# EAGLE design PixelLeaf RP2040 (EAGLE 9.5.2)
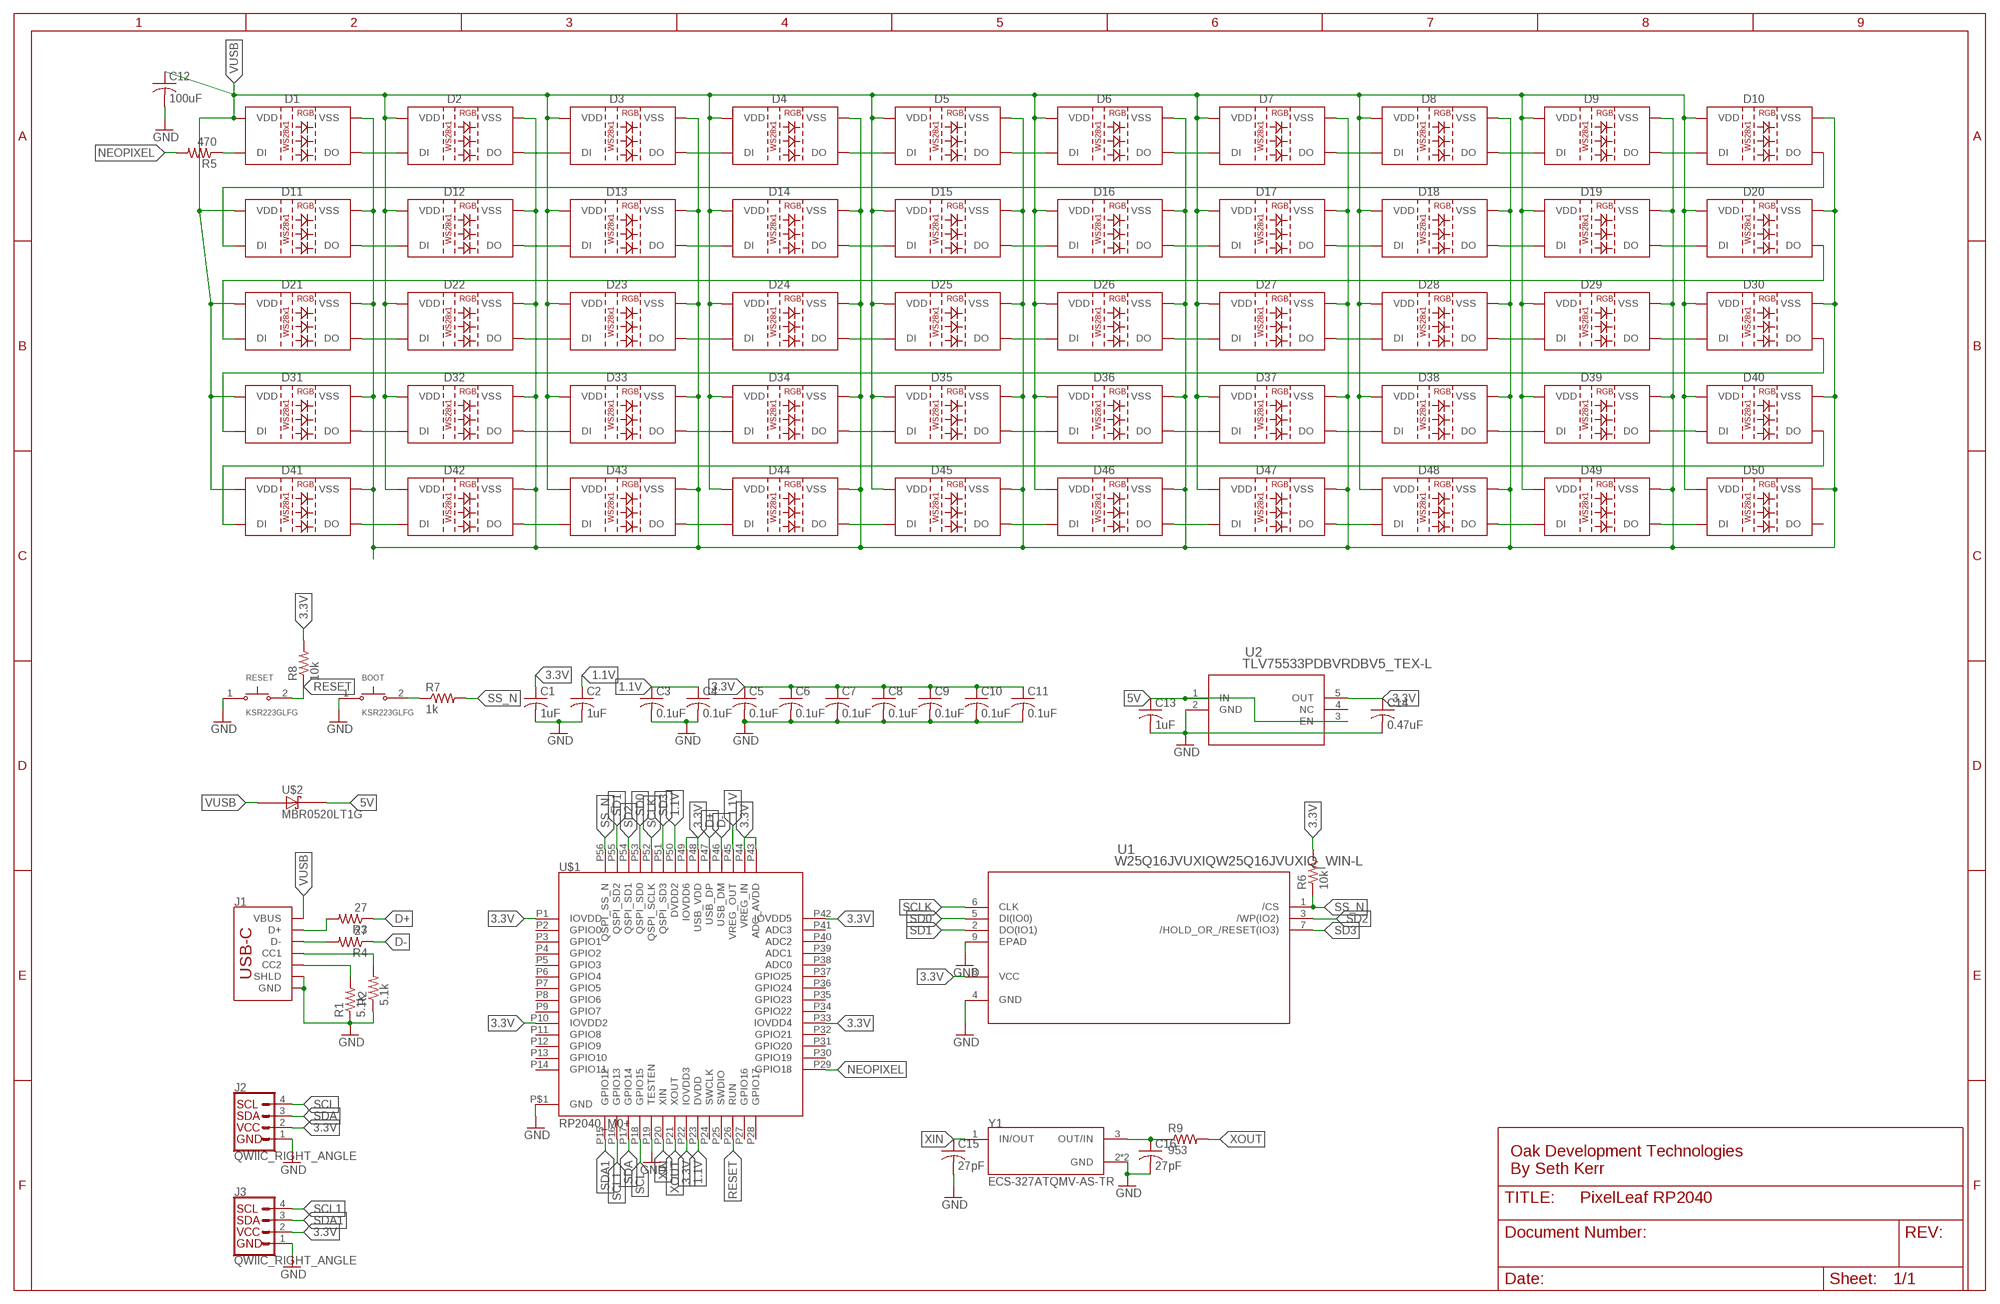
[diagram p0: schematic, sheet 1]

## Parts
BOOT  KSR223GLFG  [SW_KSR223GLFG]
C1  1uF  C-USC0603  [C0603]
C2  1uF  C-USC0603  [C0603]
C3  0.1uF  C-USC0603  [C0603]
C4  0.1uF  C-USC0603  [C0603]
C5  0.1uF  C-USC0603  [C0603]
C6  0.1uF  C-USC0603  [C0603]
C7  0.1uF  C-USC0603  [C0603]
C8  0.1uF  C-USC0603  [C0603]
C9  0.1uF  C-USC0603  [C0603]
C10  0.1uF  C-USC0603  [C0603]
C11  0.1uF  C-USC0603  [C0603]
C12  100uF  C-USC1206  [C1206]
C13  1uF  C-USC0603  [C0603]
C14  0.47uF  C-USC0603  [C0603]
C15  27pF  C-USC0402  [C0402]
C16  27pF  C-USC0402  [C0402]
D1  WS2812BWS2812B-3535  [WS2812-3535]
D2  WS2812BWS2812B-3535  [WS2812-3535]
D3  WS2812BWS2812B-3535  [WS2812-3535]
D4  WS2812BWS2812B-3535  [WS2812-3535]
D5  WS2812BWS2812B-3535  [WS2812-3535]
D6  WS2812BWS2812B-3535  [WS2812-3535]
D7  WS2812BWS2812B-3535  [WS2812-3535]
D8  WS2812BWS2812B-3535  [WS2812-3535]
D9  WS2812BWS2812B-3535  [WS2812-3535]
D10  WS2812BWS2812B-3535  [WS2812-3535]
D11  WS2812BWS2812B-3535  [WS2812-3535]
D12  WS2812BWS2812B-3535  [WS2812-3535]
D13  WS2812BWS2812B-3535  [WS2812-3535]
D14  WS2812BWS2812B-3535  [WS2812-3535]
D15  WS2812BWS2812B-3535  [WS2812-3535]
D16  WS2812BWS2812B-3535  [WS2812-3535]
D17  WS2812BWS2812B-3535  [WS2812-3535]
D18  WS2812BWS2812B-3535  [WS2812-3535]
D19  WS2812BWS2812B-3535  [WS2812-3535]
D20  WS2812BWS2812B-3535  [WS2812-3535]
D21  WS2812BWS2812B-3535  [WS2812-3535]
D22  WS2812BWS2812B-3535  [WS2812-3535]
D23  WS2812BWS2812B-3535  [WS2812-3535]
D24  WS2812BWS2812B-3535  [WS2812-3535]
D25  WS2812BWS2812B-3535  [WS2812-3535]
D26  WS2812BWS2812B-3535  [WS2812-3535]
D27  WS2812BWS2812B-3535  [WS2812-3535]
D28  WS2812BWS2812B-3535  [WS2812-3535]
D29  WS2812BWS2812B-3535  [WS2812-3535]
D30  WS2812BWS2812B-3535  [WS2812-3535]
D31  WS2812BWS2812B-3535  [WS2812-3535]
D32  WS2812BWS2812B-3535  [WS2812-3535]
D33  WS2812BWS2812B-3535  [WS2812-3535]
D34  WS2812BWS2812B-3535  [WS2812-3535]
D35  WS2812BWS2812B-3535  [WS2812-3535]
D36  WS2812BWS2812B-3535  [WS2812-3535]
D37  WS2812BWS2812B-3535  [WS2812-3535]
D38  WS2812BWS2812B-3535  [WS2812-3535]
D39  WS2812BWS2812B-3535  [WS2812-3535]
D40  WS2812BWS2812B-3535  [WS2812-3535]
D41  WS2812BWS2812B-3535  [WS2812-3535]
D42  WS2812BWS2812B-3535  [WS2812-3535]
D43  WS2812BWS2812B-3535  [WS2812-3535]
D44  WS2812BWS2812B-3535  [WS2812-3535]
D45  WS2812BWS2812B-3535  [WS2812-3535]
D46  WS2812BWS2812B-3535  [WS2812-3535]
D47  WS2812BWS2812B-3535  [WS2812-3535]
D48  WS2812BWS2812B-3535  [WS2812-3535]
D49  WS2812BWS2812B-3535  [WS2812-3535]
D50  WS2812BWS2812B-3535  [WS2812-3535]
J1  USB_C_2-LAYER_PADS  [USB-C-16P-2LAYER-PADS]
J2  QWIIC_RIGHT_ANGLE  QWIIC_CONNECTORJS-1MM  [JST04_1MM_RA]
J3  QWIIC_RIGHT_ANGLE  QWIIC_CONNECTORJS-1MM  [JST04_1MM_RA]
R1  5.1k  R-US_R0603  [R0603]
R2  5.1k  R-US_R0603  [R0603]
R3  27  R-US_R0603  [R0603]
R4  27  R-US_R0603  [R0603]
R5  470  R-US_R0603  [R0603]
R6  10k  R-US_R0603  [R0603]
R7  1k  R-US_R0603  [R0603]
R8  10k  R-US_R0603  [R0603]
R9  953  R-US_R0402  [R0402]
RESET  KSR223GLFG  [SW_KSR223GLFG]
U1  W25Q16JVUXIQW25Q16JVUXIQ_WIN-L  [W25Q16JVUXIQ_WIN-L]
U2  TLV75533PDBVRDBV5_TEX-L  [DBV5_TEX-L]
U$1  RP2040_M0+  [QFN-56]
U$2  MBR0520LT1G  [SOD3716X117(SOD-123)]
Y1  ECS-327ATQMV-AS-TR  [XTAL_ECS-327ATQMV-AS-TR]

## Nets
1.1V: C2.1 C3.1 C4.1 U$1.P23(DVDD) U$1.P45(VREG_OUT) U$1.P50(DVDD2)
3.3V: C1.1 C5.1 C6.1 C7.1 C8.1 C9.1 C10.1 C11.1 C14.1 J2.2 J3.2 R6.2 R8.2 U1.8(VCC) U2.5(OUT) U$1.P1(IOVDD) U$1.P10(IOVDD2) U$1.P22(IOVDD3) U$1.P33(IOVDD4) U$1.P42(IOVDD5) U$1.P43(ADC_AVDD) U$1.P44(VREG_IN) U$1.P48(USB_VDD) U$1.P49(IOVDD6)
5V: C13.1 U2.1(IN) U2.3(EN) U$2.1(C)
D+: R3.1 U$1.P47(USB_DP)
D-: R4.1 U$1.P46(USB_DM)
GND: BOOT.1 C1.2 C2.2 C3.2 C4.2 C5.2 C6.2 C7.2 C8.2 C9.2 C10.2 C11.2 C12.2 C13.2 C14.2 C15.2 C16.2 D1.VSS D2.VSS D3.VSS D4.VSS D5.VSS D6.VSS D7.VSS D8.VSS D9.VSS D10.VSS D11.VSS D12.VSS D13.VSS D14.VSS D15.VSS D16.VSS D17.VSS D18.VSS D19.VSS D20.VSS D21.VSS D22.VSS D23.VSS D24.VSS D25.VSS D26.VSS D27.VSS D28.VSS D29.VSS D30.VSS D31.VSS D32.VSS D33.VSS D34.VSS D35.VSS D36.VSS D37.VSS D38.VSS D39.VSS D40.VSS D41.VSS D42.VSS D43.VSS D44.VSS D45.VSS D46.VSS D47.VSS D48.VSS D49.VSS D50.VSS J1.GND J1.GND2(GND) J1.P$1(SHLD) J1.P$2(SHLD) J1.P$3(SHLD) J1.P$4(SHLD) J1.SHLD1(SHLD) J1.SHLD2(SHLD) J1.SHLD3(SHLD) J1.SHLD4(SHLD) J2.1 J3.1 R1.1 R2.1 RESET.1 U1.4(GND) U1.9(EPAD) U2.2(GND) U$1.P19(TESTEN) U$1.P$1(GND) Y1.2(GND) Y1.4(GND)
N$1: J1.A6(D+) J1.B6(D+) R3.2
N$2: J1.A7(D-) J1.B7(D-) R4.2
N$3: J1.A5(CC1) R2.2
N$4: J1.B5(CC2) R1.2
N$5: D1.DIN(DI) R5.1
N$8: C16.1 R9.1 Y1.3(OUT/IN)
N$12: D41.DOUT(DO) D42.DIN(DI)
N$13: D42.DOUT(DO) D43.DIN(DI)
N$14: D43.DOUT(DO) D44.DIN(DI)
N$15: D44.DOUT(DO) D45.DIN(DI)
N$16: D45.DOUT(DO) D46.DIN(DI)
N$17: D46.DOUT(DO) D47.DIN(DI)
N$18: D47.DOUT(DO) D48.DIN(DI)
N$19: D48.DOUT(DO) D49.DIN(DI)
N$20: D49.DOUT(DO) D50.DIN(DI)
N$21: D40.DOUT(DO) D41.DIN(DI)
N$22: D31.DOUT(DO) D32.DIN(DI)
N$23: D32.DOUT(DO) D33.DIN(DI)
N$24: D33.DOUT(DO) D34.DIN(DI)
N$25: D34.DOUT(DO) D35.DIN(DI)
N$26: D35.DOUT(DO) D36.DIN(DI)
N$27: D36.DOUT(DO) D37.DIN(DI)
N$28: D37.DOUT(DO) D38.DIN(DI)
N$29: D38.DOUT(DO) D39.DIN(DI)
N$30: D39.DOUT(DO) D40.DIN(DI)
N$31: D30.DOUT(DO) D31.DIN(DI)
N$32: D21.DOUT(DO) D22.DIN(DI)
N$33: D22.DOUT(DO) D23.DIN(DI)
N$34: D23.DOUT(DO) D24.DIN(DI)
N$35: D24.DOUT(DO) D25.DIN(DI)
N$36: D25.DOUT(DO) D26.DIN(DI)
N$37: D26.DOUT(DO) D27.DIN(DI)
N$38: D27.DOUT(DO) D28.DIN(DI)
N$39: D28.DOUT(DO) D29.DIN(DI)
N$40: D29.DOUT(DO) D30.DIN(DI)
N$41: D20.DOUT(DO) D21.DIN(DI)
N$42: D11.DOUT(DO) D12.DIN(DI)
N$43: D12.DOUT(DO) D13.DIN(DI)
N$44: D13.DOUT(DO) D14.DIN(DI)
N$45: D14.DOUT(DO) D15.DIN(DI)
N$46: D15.DOUT(DO) D16.DIN(DI)
N$47: D16.DOUT(DO) D17.DIN(DI)
N$48: D17.DOUT(DO) D18.DIN(DI)
N$49: D18.DOUT(DO) D19.DIN(DI)
N$50: D19.DOUT(DO) D20.DIN(DI)
N$51: D10.DOUT(DO) D11.DIN(DI)
N$52: D1.DOUT(DO) D2.DIN(DI)
N$53: D2.DOUT(DO) D3.DIN(DI)
N$54: D3.DOUT(DO) D4.DIN(DI)
N$55: D4.DOUT(DO) D5.DIN(DI)
N$56: D5.DOUT(DO) D6.DIN(DI)
N$57: D6.DOUT(DO) D7.DIN(DI)
N$58: D7.DOUT(DO) D8.DIN(DI)
N$59: D8.DOUT(DO) D9.DIN(DI)
N$60: D9.DOUT(DO) D10.DIN(DI)
N$69: BOOT.2 R7.1
NEOPIXEL: R5.2 U$1.P29(GPIO18)
RESET: R8.1 RESET.2 U$1.P26(RUN)
SCL: J2.4 U$1.P18(GPIO15)
SCL1: J3.4 U$1.P16(GPIO13)
SCLK: U1.6(CLK) U$1.P52(QSPI_SCLK)
SD0: U1.5(DI(IO0)) U$1.P53(QSPI_SD0)
SD1: U1.2(DO(IO1)) U$1.P55(QSPI_SD2)
SD2: U1.3(/WP(IO2)) U$1.P54(QSPI_SD1)
SD3: U1.7(/HOLD_OR_/RESET(IO3)) U$1.P51(QSPI_SD3)
SDA: J2.3 U$1.P17(GPIO14)
SDA1: J3.3 U$1.P15(GPIO12)
SS_N: R6.1 R7.2 U1.1(/CS) U$1.P56(QSPI_SS_N)
VUSB: C12.1 D1.VDD D2.VDD D3.VDD D4.VDD D5.VDD D6.VDD D7.VDD D8.VDD D9.VDD D10.VDD D11.VDD D12.VDD D13.VDD D14.VDD D15.VDD D16.VDD D17.VDD D18.VDD D19.VDD D20.VDD D21.VDD D22.VDD D23.VDD D24.VDD D25.VDD D26.VDD D27.VDD D28.VDD D29.VDD D30.VDD D31.VDD D32.VDD D33.VDD D34.VDD D35.VDD D36.VDD D37.VDD D38.VDD D39.VDD D40.VDD D41.VDD D42.VDD D43.VDD D44.VDD D45.VDD D46.VDD D47.VDD D48.VDD D49.VDD D50.VDD J1.VBUS1(VBUS) J1.VBUS2(VBUS) U$2.2(A)
XIN: C15.1 U$1.P20(XIN) Y1.1(IN/OUT)
XOUT: R9.2 U$1.P21(XOUT)
Unconnected: D50.DOUT(DO) U2.4(NC) U$1.P2(GPIO0) U$1.P3(GPIO1) U$1.P4(GPIO2) U$1.P5(GPIO3) U$1.P6(GPIO4) U$1.P7(GPIO5) U$1.P8(GPIO6) U$1.P9(GPIO7) U$1.P11(GPIO8) U$1.P12(GPIO9) U$1.P13(GPIO10) U$1.P14(GPIO11) U$1.P24(SWCLK) U$1.P25(SWDIO) U$1.P27(GPIO16) U$1.P28(GPIO17) U$1.P30(GPIO19) U$1.P31(GPIO20) U$1.P32(GPIO21) U$1.P34(GPIO22) U$1.P35(GPIO23) U$1.P36(GPIO24) U$1.P37(GPIO25) U$1.P38(ADC0) U$1.P39(ADC1) U$1.P40(ADC2) U$1.P41(ADC3)

## Notes on the sheet
- Oak Development Technologies
  By Seth Kerr

## Library data of the parts
BOOT RESET = KSR223GLFG:KSR223GLFG: Switch Tactile N.O. SPST Round Button Gull Wing 0.01A 32VDC 0.2VA 200000Cycles 2N SMD Automotive T/R; AVAILABILITY: Unavailable; DESCRIPTION: Tactile Switch SPST-NO Top Actuated Surface Mount; MF: C&K; MP: KSR223GLFG; PACKAGE: None; PRICE: None
C1-C16 = rcl:C-US: CAPACITOR, American symbol; SPICEPREFIX: C
D1-D50 = SparkFun-LED:WS2812B: WS2812B SMD addressable RGB LED 5x5mm SMD LED with built-in controller IC. Color: Red/Green/Blue mC Rating: RGB: 390, 660, 180 mcd Forward Voltage: RGB: 2.0, 3.0, 3.0 V Packages:WS2812B SparkFun Products: Blynk Board - ESP8266 <https://www.sparkfun.com/products/13794>
J1 = SparkFun-Connectors:USB_C: USB Type C 16Pin Connector Super Speed pins not available on the 16-pin purely SMD connector so this part is best for USB 2.0 implementations. D1 and D2 are tied together enabling D+/- no matter which way the cable is plugged into the connector. The two channel configuration pins (CC1/2) are exposed. These are normally connected to ground via 5.1k resistors but can be reconfigured for high current/high power applications.; PROD_ID: CONN-14122
J2 J3 = SparkFun-Connectors:QWIIC_CONNECTOR: SparkFun I2C Standard Qwiic Connector An SMD 1mm pitch JST connector makes it easy and quick (get it? Qwiic?) to connect I2C devices to each other. The Qwiic system <http://www.sparkfun.com/qwiic> enables fast and solderless connection between popular platforms and various sensors and actuators. We carry 200mm <https://www.sparkfun.com/products/14204>, 100mm <https://www.sparkfun.com/products/14205>, 50mm <https://www.sparkfun.com/products/14206>, and breadboard friendly <https://www.sparkfun.com/products/14207> Qwiic cables. We also offer 10 pcs strips <https://www.sparkfun.com/products/14323> the SMD connectors.; PROD_ID: CONN-13694
R1-R9 = rcl:R-US_: RESISTOR, American symbol; SPICEPREFIX: R
U1 = Winbond SPI Flash:W25Q16JVUXIQ; BUILT_BY: EMA_Colton; COPYRIGHT: Copyright (C) 2018 Accelerated Designs. All rights reserved; DATASHEET: https://www.mouser.com/datasheet/2/949/w25n01gw_reve_021318_unsecured-1489855.pdf; MANUFACTURER_PART_NUMBER: W25Q16JVUXIQ; SOURCELIBRARY: Winbond_2020-03-18; VENDOR: Winbond
U2 = TLV75533pdbvr:TLV75533PDBVR; COPYRIGHT: Copyright (C) 2018 Accelerated Designs. All rights reserved; MANUFACTURER_PART_NUMBER: TLV75533PDBVR; SOURCELIBRARY: TI_2019-06-18; VENDOR: Texas Instruments
U$1 = RP2040_M0:RP2040_M0+
U$2 = MBR0520LT1G:MBR0520LT1G: Surface Mount Schottky Power Rectifier Plastic SOD−123 Package; AVAILABILITY: Unavailable; DESCRIPTION: Diode Schottky 20V 500mA Surface Mount SOD-123; MF: ON Semiconductor; MP: MBR0520LT1G; PACKAGE: SOD-123 ON Semiconductor; PRICE: None
Y1 = ECS-327ATQMV-AS-TR:ECS-327ATQMV-AS-TR: The ECX-33Q is a miniature SMD Crystal with a 3.2 x 2.5 mm footprint. AEC-Q200 Qualified.; ARROW_ELECTRONICS-PURCHASE-URL: https://snapeda.com/shop?store=Arrow+Electronics&id=3210300; DESCRIPTION: 32.768kHz XO (Standard) CMOS Oscillator 1.62V ~ 3.63V Enable/Disable 4-SMD, No Lead; DIGI-KEY_PART_NUMBER: XC2826CT-ND; MF: ECS Inc.; MOUSER-PURCHASE-URL: https://snapeda.com/shop?store=Mouser&id=3210300; MP: ECS-327ATQMV-AS-TR; PACKAGE: SMD-4 ECS Inc.

## Board
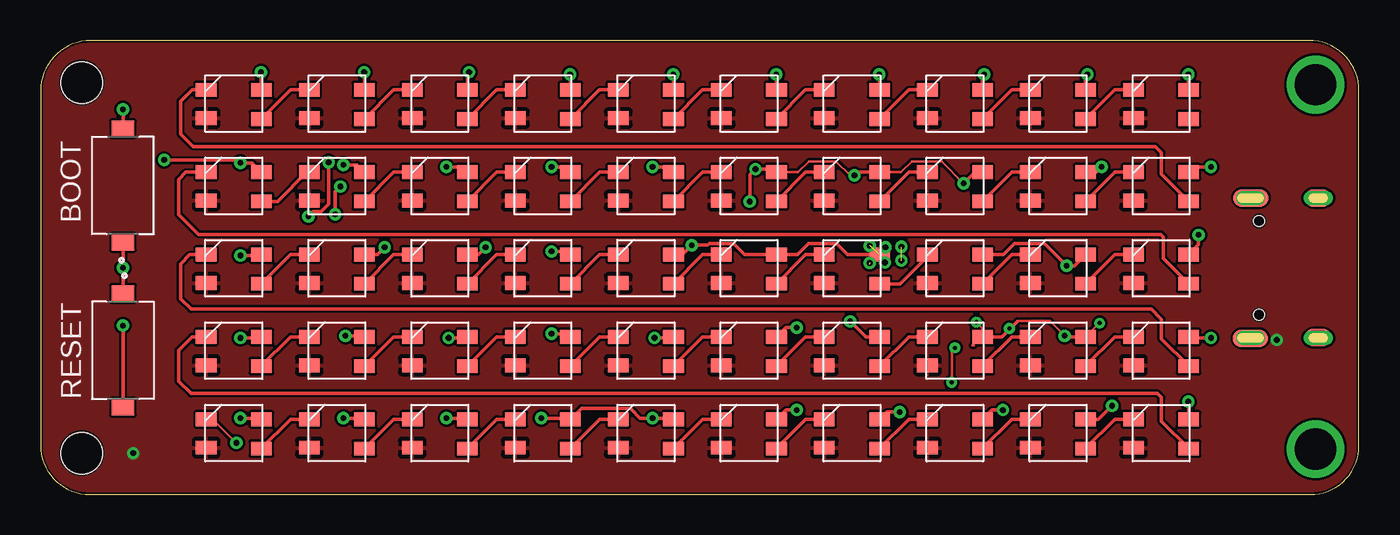
[diagram p1: board, top side]
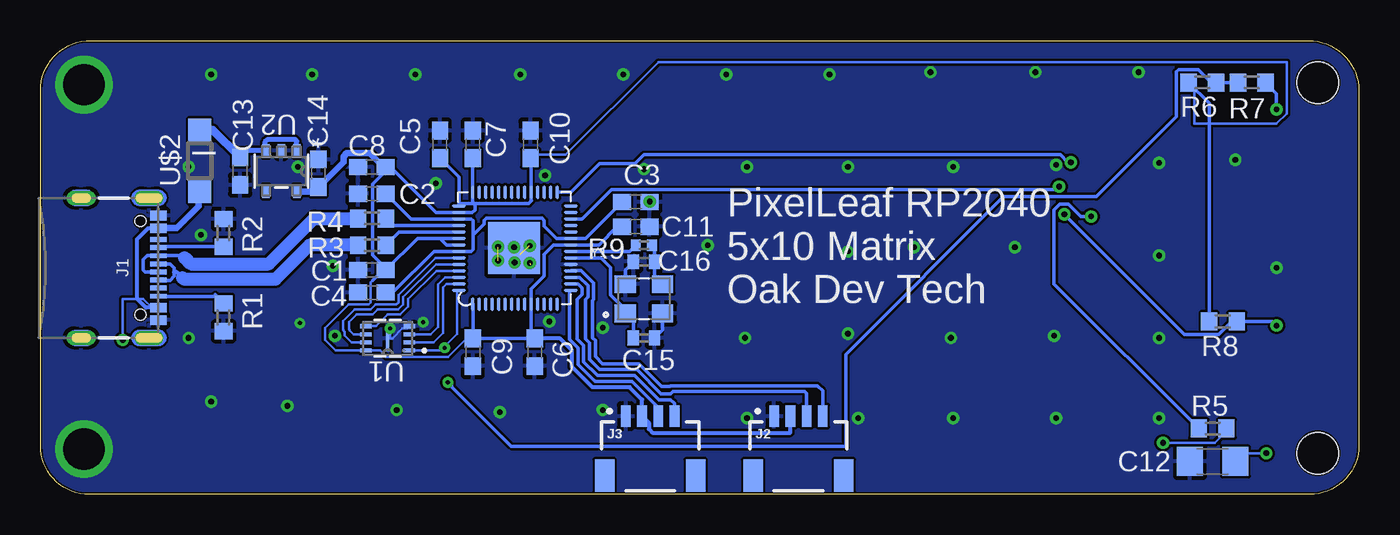
[diagram p2: board, bottom side, seen from below]

Size 81.26 x 27.99 mm. Coordinates in mm from the lower left corner, seen from the top.
Outline: 0,24.88 0,3.04 arc90 3.04,0 78.26,0 arc90 81.26,3 81.26,24.9 arc90 78.17,27.99 3.11,27.99 arc90 0,24.88
Copper layers (1*16): Top 0.035mm / dielectric 1.5mm / Bottom 0.035mm
Design rules "default *": minimum track width 6mil, minimum drill 10mil, track to track 6mil, track to pad 6mil, pad to pad 6mil, via to via 6mil, smd to smd 6mil, copper to edge 5mil, drill to drill 6mil, minimum pad ring 10mil, minimum via ring 8mil, stop-mask expansion 1mil, vias tented up to drill 15mil, thermal gap 10mil
Holes 2.54 mm at 2.54,2.54 2.54,25.4

### Footprints (pad centres in the part's own frame; a part is rotated, then mirrored left to right if it is on the bottom)
SW_KSR223GLFG = smd 1 x 1.4: 1 -3.5,0; 2 3.5,0
C0603 = smd 1.1 x 1: 1 -0.85,0; 2 0.85,0
C1206 = smd 1.6 x 1.8: 1 -1.4,0; 2 1.4,0
C0402 = smd 0.7 x 0.9: 1 -0.65,0; 2 0.65,0
WS2812-3535 = smd 1.27 x 0.85: DIN 0.05,2.6; DOUT 3.45,0.8; VDD 0.05,0.85; VSS 3.45,2.6
USB-C-16P-2LAYER-PADS = smd 0.3 x 1: A5 -1.25,-0.34; A6 -0.25,-0.34; A7 0.25,-0.34; A8 1.25,-0.34; B5 1.75,-0.34; B6 0.75,-0.34; B7 -0.75,-0.34; B8 -1.75,-0.34 | smd 0.6 x 1: GND -3.225,-0.34; GND2 3.225,-0.34; VBUS1 -2.45,-0.34; VBUS2 2.45,-0.34 | smd 1.067 x 2.184 bottom: P$1 -4.318,-0.94; P$2 4.343,-0.914 | smd 1.067 x 1.676 bottom: P$3 -4.318,-5.08; P$4 4.293,-5.08 | drill 0.4 pad 0.6 long: SHLD1 -4.318,-0.915; SHLD2 4.318,-0.915; SHLD3 -4.318,-5.095; SHLD4 4.318,-5.095 | hole 0.65: -2.89,-1.445; 2.89,-1.445
JST04_1MM_RA = smd 0.6 x 1.35: 1 -1.5,0; 2 -0.5,0; 3 0.5,0; 4 1.5,0 | smd 1.2 x 2: NC1 2.8,-3.675; NC2 -2.8,-3.675
R0603 = smd 1 x 1.1: 1 -0.85,0; 2 0.85,0
R0402 = smd 0.6 x 0.7: 1 -0.5,0; 2 0.5,0
W25Q16JVUXIQ_WIN-L = smd 0.711 x 0.254: 1 -1.348,0.75; 2 -1.348,0.25; 3 -1.348,-0.25; 4 -1.348,-0.75; 5 1.348,-0.75; 6 1.348,-0.25; 7 1.348,0.25; 8 1.348,0.75 | smd 0.203 x 1.6: 9 0,0
DBV5_TEX-L = smd 0.775 x 0.457: 1 -1.264,0.95; 2 -1.264,0; 3 -1.264,-0.95; 4 1.264,-0.95; 5 1.264,0.95
QFN-56 = smd 0.875 x 0.2: P1 -3.5,2.55; P2 -3.5,2.15; P3 -3.5,1.75; P4 -3.5,1.35; P5 -3.5,0.95; P6 -3.5,0.55; P7 -3.5,0.15; P8 -3.5,-0.25; P9 -3.5,-0.65; P10 -3.5,-1.05; P11 -3.5,-1.45; P12 -3.5,-1.85; P13 -3.5,-2.25; P14 -3.5,-2.65; P29 3.4,-2.65; P30 3.4,-2.25; P31 3.4,-1.85; P32 3.4,-1.45; P33 3.4,-1.05; P34 3.4,-0.65; P35 3.4,-0.25; P36 3.4,0.15; P37 3.4,0.55; P38 3.4,0.95; P39 3.4,1.35; P40 3.4,1.75; P41 3.4,2.15; P42 3.4,2.55 | smd 0.2 x 0.875: P15 -2.65,-3.5; P16 -2.25,-3.5; P17 -1.85,-3.5; P18 -1.45,-3.5; P19 -1.05,-3.5; P20 -0.65,-3.5; P21 -0.25,-3.5; P22 0.15,-3.5; P23 0.55,-3.5; P24 0.95,-3.5; P25 1.35,-3.5; P26 1.75,-3.5; P27 2.15,-3.5; P28 2.55,-3.5; P43 2.55,3.4; P44 2.15,3.4; P45 1.75,3.4; P46 1.35,3.4; P47 0.95,3.4; P48 0.55,3.4; P49 0.15,3.4; P50 -0.25,3.4; P51 -0.65,3.4; P52 -1.05,3.4; P53 -1.45,3.4; P54 -1.85,3.4; P55 -2.25,3.4; P56 -2.65,3.4 | smd 3.2 x 3.2: P$1 -0.05,0
SOD3716X117(SOD-123) = smd 1.4 x 1.4: 1 -1.9,0.051; 2 1.9,0.051
XTAL_ECS-327ATQMV-AS-TR = smd 1.3 x 1.1: 1 -1.15,-0.9; 2 1.15,-0.9; 3 1.15,0.9; 4 -1.15,0.9

### Placement (x,y rotation side)
BOOT  5.08,19.05 90 top
C1  60.83,13.84 180 bottom
C2  60.83,18.54 180 bottom
C3  44.58,18.03 0 bottom
C4  60.83,12.45 180 bottom
C5  56.64,21.59 90 bottom
C6  50.8,8.76 270 bottom
C7  54.61,21.59 90 bottom
C8  60.83,20.19 180 bottom
C9  54.61,8.76 270 bottom
C10  51.05,21.59 90 bottom
C11  44.58,16.51 0 bottom
C12  9.02,2.03 180 bottom
C13  68.96,19.94 270 bottom
C14  64.14,19.81 90 bottom
C15  44.07,9.65 0 bottom
C16  44.07,14.35 180 bottom
D1  10.16,2.03 0 top
D2  16.51,2.03 0 top
D3  22.86,2.03 0 top
D4  29.21,2.03 0 top
D5  35.56,2.03 0 top
D6  41.91,2.03 0 top
D7  48.26,2.03 0 top
D8  54.61,2.03 0 top
D9  60.96,2.03 0 top
D10  67.31,2.03 0 top
D11  10.16,7.11 0 top
D12  16.51,7.11 0 top
D13  22.86,7.11 0 top
D14  29.21,7.11 0 top
D15  35.56,7.11 0 top
D16  41.91,7.11 0 top
D17  48.26,7.11 0 top
D18  54.61,7.11 0 top
D19  60.96,7.11 0 top
D20  67.31,7.11 0 top
D21  10.16,12.19 0 top
D22  16.51,12.19 0 top
D23  22.86,12.19 0 top
D24  29.21,12.19 0 top
D25  35.56,12.19 0 top
D26  41.91,12.19 0 top
D27  48.26,12.19 0 top
D28  54.61,12.19 0 top
D29  60.96,12.19 0 top
D30  67.31,12.19 0 top
D31  10.16,17.27 0 top
D32  16.51,17.27 0 top
D33  22.86,17.27 0 top
D34  29.21,17.27 0 top
D35  35.56,17.27 0 top
D36  41.91,17.27 0 top
D37  48.26,17.27 0 top
D38  54.61,17.27 0 top
D39  60.96,17.27 0 top
D40  67.31,17.27 0 top
D41  10.16,22.35 0 top
D42  16.51,22.35 0 top
D43  22.86,22.35 0 top
D44  29.21,22.35 0 top
D45  35.56,22.35 0 top
D46  41.91,22.35 0 top
D47  48.26,22.35 0 top
D48  54.61,22.35 0 top
D49  60.96,22.35 0 top
D50  67.31,22.35 0 top
J1  73.66,13.97 270 bottom
J2  34.54,4.83 0 bottom
J3  43.69,4.83 0 bottom
R1  69.98,10.92 90 bottom
R2  69.98,16.13 270 bottom
R3  60.83,15.37 180 bottom
R4  60.83,17.02 180 bottom
R5  9.02,4.06 180 bottom
R6  9.65,25.4 180 bottom
R7  6.6,25.4 180 bottom
R8  8.38,10.67 180 bottom
R9  44.07,15.37 180 bottom
RESET  5.08,8.89 270 top
U1  59.87,9.63 180 bottom
U2  66.42,19.94 270 bottom
U$1  52.07,15.24 90 bottom
U$2  71.5,20.57 270 bottom
Y1  44.07,12.06 0 bottom

### Tracks (layer width: path | path; a pad name or v marks a point on that pad's centre or on a via)
1.1V
  Bottom 0.203: C4.1 59.56,12.45 57.02,14.99 U$1.P50 54.73,14.99 54.61,15.11 54.61,16 | C2.1 58.43,16.99 U$1.P45 54.71,16.99 54.61,16.89 54.61,16 | 54.61,16 53.92,16.69 53.92,16.89 53.77,17.04 50.37,17.04 50.22,16.89 50.22,16.56 49.45,15.79 U$1.P23 47.67,15.79 C3.1
3.3V
  Bottom 0.152: R6.2 10.16,25.4 10.16,22.86 5.08,22.86 4.45,23.5 4.45,26.67 43.18,26.67 48.9,20.95 50.8,20.95 C10.1 | 60.79,13.18 60.9,13.06 60.9,11.85 61.05,11.71 62.28,11.71 63.73,10.26 63.73,9.53 63.08,8.88 U1.8 60.34,8.88 59.95,8.48 56.13,8.48 55,9.61 C9.1
  Bottom 0.203: U$1.P48 56.64,15.79 | U$1.P49 56.24,15.39 56.64,15.79 | 56.64,15.79 58.04,15.79 C1.1 | C9.1 U$1.P1 | 54.62,20.7 U$1.P42 54.62,18.07 54.48,17.93 | 54.62,20.7 C7.1 | C5.1 55.47,19.57 U$1.P43 55.33,17.93 54.48,17.93 | C10.1 51.02,20.71 U$1.P33 51.02,18.13 51,18.11 51.18,17.93 54.48,17.93 | 45.43,16.62 C11.1 45.72,16.51 46.84,15.39 U$1.P22 49.63,15.39 50.22,14.81 50.22,13.48 51.02,12.68 U$1.P10 51.02,9.83 C6.1 C9.1 | 54.58,20.74 54.62,20.7 | C1.1 59.98,13.96 60.79,14.76 60.79,19.15 59.98,19.95 C8.1 59.69,20.19 56.89,17.39 U$1.P44 54.68,17.39 54.66,17.37 54.48,17.55 54.48,17.93 | C1.1 60.12,13.84 60.79,13.18 | 54.64,9.61 C9.1 | R8.2 9.23,24.13 R6.2
  Bottom 0.254: J2.2 35.04,3.82 35.05,3.81 43.54,3.81 43.77,4.04 43.77,4.41 J3.2 44.19,5.83 44.96,6.6 47.24,6.6 48.51,7.87 48.51,8.89 49.24,9.61 C6.1
  Bottom 0.406: U2.5 64.42,18.68 C14.1 62.59,20.51 62.59,20.84 62.38,21.05 60.99,21.05 60.13,20.19 C8.1
5V
  Bottom 0.305: C13.1 68.55,21.2 U2.3 67.44,21.27 67.44,21.72 67.26,21.89 65.58,21.89 65.47,21.78 U2.1
  Bottom 0.508: C13.1 70.65,22.47 U$2.1
D+
  Bottom 0.203: U$1.P47 59.16,16.19 R3.1
D-
  Bottom 0.203: U$1.P46 59.55,16.59 R4.1
GND  (via drill 0.25, 0.35, 2.54)  (3 unrouted)
  Top 0.152: 57.54,9.2 57.47,9.2 | 57.47,9.2 57.43,9.2 | v50.16,19.68 49.88,19.68 49.04,20.53 47.35,20.53 46.69,19.87 D36.VSS | D37.VSS 53.04,19.87 53.7,20.53 55.55,20.53 v56.9,19.18 | 63.19,9.71 62.2,10.69 60.22,10.69 60.2,10.67 | v57.68,10.62 58.06,10.24 D18.VSS 57.78,9.53 57.47,9.21 57.47,9.2 | D19.VSS 65.26,10.57 v65.28,10.57
  Top 0.203: BOOT.1 v5.08,13.97 RESET.1 | D7.VSS 52.16,5.08 v52.96,5.08 | D8.VSS 58.63,5.21 v59.31,5.21 | v66.04,5.46 65.21,4.63 D9.VSS | v70.74,5.71 70.76,5.69 D10.VSS | D20.VSS 70.82,9.65 v72.14,9.65 | D19.VSS 63.19,9.71 v63.12,9.78 | D18.VSS 59.24,9.71 60.2,10.67 | D17.VSS 50.87,9.71 v49.91,10.67 | D16.VSS 45.94,10.29 v46.61,10.29 | D15.VSS 38.95,9.65 v37.85,9.65 | D6.VSS 45.94,5.21 v46.61,5.21 | D5.VSS 38.94,4.7 v37.72,4.7 36.96,4.7 36.35,5.31 33.34,5.31 D4.VSS 32.59,4.7 v30.86,4.7 | v31.5,9.91 32.47,9.91 D14.VSS | v25.02,4.7 26.24,4.7 D3.VSS | v25.15,9.65 26.25,9.65 D13.VSS | v18.8,9.78 19.89,9.78 D12.VSS | v18.67,4.7 19.89,4.7 D2.VSS | v12.32,4.7 13.54,4.7 D1.VSS | v12.32,9.65 13.55,9.65 D11.VSS | v12.32,14.73 13.55,14.73 D21.VSS | v12.32,20.45 12.37,20.45 | 12.37,20.45 13.04,20.45 D31.VSS | v18.67,20.32 19.51,20.32 D32.VSS | D22.VSS 20.76,14.79 v21.21,15.24 | v25.02,20.19 25.99,20.19 D33.VSS | D23.VSS 26.98,14.79 v27.43,15.24 | v31.5,20.19 32.34,20.19 D34.VSS | v31.5,14.99 32.47,14.99 D24.VSS | v37.72,20.19 38.69,20.19 D35.VSS | D25.VSS 39.56,14.79 v40.13,15.37 41.12,15.37 41.22,15.47 42.7,15.47 43.38,14.79 D26.VSS 46.66,14.79 47.34,15.47 49.05,15.47 49.73,14.79 D27.VSS 51.71,14.88 v52.07,15.24 | D36.VSS 45.17,20.07 v44.07,20.07 43.71,19.71 v43.71,18.06 | v50.16,19.68 50.35,19.87 D37.VSS | v56.9,19.18 57.59,19.87 D38.VSS | D28.VSS 59.36,14.79 60.04,15.47 61.87,15.47 v63.25,14.1 63.72,14.1 D29.VSS | D39.VSS 65.08,19.87 v65.41,20.19 | D30.VSS 71.37,15.41 v71.37,16 | D40.VSS 71.08,20.19 v72.14,20.19 | D50.VSS 70.74,24.97 v70.74,25.91 | D49.VSS 64.41,25.8 v64.52,25.91 | D48.VSS 58.06,25.8 v58.17,25.91 | D47.VSS 51.71,25.89 v51.69,25.91
  Top 0.203: D46.VSS 45.36,25.89 v45.34,25.91 | D45.VSS 39.01,25.89 v38.99,25.91 | D44.VSS 32.66,25.89 v32.64,25.91 | D43.VSS 26.31,25.93 v26.42,26.04 | D42.VSS 19.96,26.01 v19.94,26.04 | D41.VSS 13.61,26.01 v13.59,26.04 | v7.62,20.62 12.19,20.62 12.37,20.45
  Bottom 0.152: C8.2 61.59,20.32 61.58,20.09 | U1.4 58.66,10.23 58.97,10.23 59.58,9.63 U1.9 59.72,9.78 v59.72,10.24
  Bottom 0.203: C16.2 45.22,13.85 Y1.4 | C15.2 42.92,10.15 Y1.2 | 51.07,14.19 U$1.P$1
  other vias: 78.59,25.27 78.59,2.79 51.1,15.34 53.06,15.27 53.06,14.43 52.04,14.3 51.1,14.27
  pour Bottom: -2.54,30.48 83.82,30.48 83.82,-2.54 -2.54,-2.54
N$1
  Bottom 0.203: J1.A6 73.28,14.22 73.03,13.97 73.03,13.72 73.03,13.46 73.28,13.21 73.99,13.21 J1.B6
  Bottom 0.254: 72.5,13.35 72.87,13.72 73.03,13.72
  Bottom 0.813: R3.2 64.67,15.37 66.79,13.26 72.41,13.26 72.5,13.35
N$2
  Bottom 0.203: J1.A7 74.81,13.72 74.93,13.84 74.93,14.48 74.69,14.72 J1.B7 72.5,14.72 72.39,14.61
  Bottom 0.813: 72.39,14.61 72,14.22 67.19,14.22 64.39,17.02 R4.2
N$3
  Bottom 0.203: R2.2 73.94,15.28 J1.A5
N$4
  Bottom 0.203: J1.B5 70.58,12.22 70.48,12.32 69.98,11.81 R1.2
N$5  (via drill 0.35)
  Top 0.152: v12.06,3.17 10.79,4.45 D1.DIN
  Bottom 0.152: v12.06,3.17 8.89,3.17 8.26,3.81 R5.1
N$8
  Bottom 0.203: Y1.3 43.43,13.47 C16.1 | C16.1 43.43,15.22 R9.1 | C16.1
N$12
  Top 0.203: D41.DOUT 15.41,24.95 D42.DIN
N$13
  Top 0.203: D42.DOUT 21.76,24.95 D43.DIN
N$14
  Top 0.203: D43.DOUT 28.11,24.95 D44.DIN
N$15
  Top 0.203: D44.DOUT 34.46,24.95 D45.DIN
N$16
  Top 0.203: D45.DOUT 40.81,24.95 D46.DIN
N$17
  Top 0.203: D46.DOUT 47.16,24.95 D47.DIN
N$18
  Top 0.203: D47.DOUT 53.51,24.95 D48.DIN
N$19
  Top 0.203: D48.DOUT 59.86,24.95 D49.DIN
N$20
  Top 0.203: D49.DOUT 66.21,24.95 D50.DIN
N$21
  Top 0.203: D40.DOUT 69.09,19.74 69.09,21.08 68.71,21.46 9.4,21.46 8.64,22.23 8.64,24.26 9.33,24.95 D41.DIN
N$22
  Top 0.203: D31.DOUT 14.6,18.07 16.4,19.87 D32.DIN
N$23
  Top 0.203: D32.DOUT 21.76,19.87 D33.DIN
N$24
  Top 0.203: D33.DOUT 28.11,19.87 D34.DIN
N$25
  Top 0.203: D34.DOUT 34.46,19.87 D35.DIN
N$26
  Top 0.203: D35.DOUT 40.81,19.87 D36.DIN
N$27
  Top 0.203: D36.DOUT 47.16,19.87 D37.DIN
N$28
  Top 0.203: D37.DOUT 53.51,19.87 D38.DIN
N$29
  Top 0.203: D38.DOUT 59.86,19.87 D39.DIN
N$30
  Top 0.203: D39.DOUT 66.21,19.87 D40.DIN
N$31
  Top 0.203: D30.DOUT 69.22,14.54 69.22,15.88 69.06,16.03 9.75,16.03 8.51,17.27 8.51,19.43 8.95,19.87 D31.DIN
N$32
  Top 0.203: D21.DOUT 15.41,14.79 D22.DIN
N$33
  Top 0.203: D22.DOUT 21.76,14.79 D23.DIN
N$34
  Top 0.203: D23.DOUT 28.11,14.79 D24.DIN
N$35
  Top 0.203: D24.DOUT 34.46,14.79 D25.DIN
N$36
  Top 0.203: D25.DOUT 40.81,14.79 D26.DIN
N$37
  Top 0.203: D26.DOUT 47.16,14.79 D27.DIN
N$38
  Top 0.203: D28.DIN 54.66,14.67 52.98,12.99 D27.DOUT
N$39
  Top 0.203: D28.DOUT 59.86,14.79 D29.DIN
N$40
  Top 0.203: D29.DOUT 66.21,14.79 D30.DIN
N$41
  Top 0.203: D20.DOUT 69.09,9.58 69.09,10.79 68.45,11.43 9.27,11.43 8.64,12.06 8.64,14.22 9.2,14.79 D21.DIN
N$42
  Top 0.203: D11.DOUT 15.41,9.71 D12.DIN
N$43
  Top 0.203: D12.DOUT 21.76,9.71 D13.DIN
N$44
  Top 0.203: D13.DOUT 28.11,9.71 D14.DIN
N$45
  Top 0.203: D14.DOUT 34.46,9.71 D15.DIN
N$46
  Top 0.203: D15.DOUT 40.81,9.71 D16.DIN
N$47
  Top 0.203: D16.DOUT 47.16,9.71 D17.DIN
N$48
  Top 0.203: D17.DOUT 53.51,9.71 D18.DIN
N$49
  Top 0.203: D18.DOUT 59.86,9.71 D19.DIN
N$50
  Top 0.203: D19.DOUT 66.21,9.71 D20.DIN
N$51
  Top 0.203: D10.DOUT 69.09,4.5 69.09,5.97 68.83,6.22 9.27,6.22 8.51,6.99 8.51,8.89 9.33,9.71 D11.DIN
N$52
  Top 0.203: D1.DOUT 15.41,4.63 D2.DIN
N$53
  Top 0.203: D2.DOUT 21.76,4.63 D3.DIN
N$54
  Top 0.203: D3.DOUT 28.11,4.63 D4.DIN
N$55
  Top 0.203: D4.DOUT 34.46,4.63 D5.DIN
N$56
  Top 0.203: D5.DOUT 40.81,4.63 D6.DIN
N$57
  Top 0.203: D6.DOUT 47.16,4.63 D7.DIN
N$58
  Top 0.203: D7.DOUT 53.51,4.63 D8.DIN
N$59
  Top 0.203: D8.DOUT 59.86,4.63 D9.DIN
N$60
  Top 0.203: D9.DOUT 66.21,4.63 D10.DIN
N$69  (via drill 0.35)
  Top 0.203: BOOT.2 v5.08,23.75
  Bottom 0.203: v5.08,23.75 5.08,24.73 R7.1
NEOPIXEL  (via drill 0.35)
  Top 0.203: v16.51,17.14 16.81,17.44 17.3,17.44 17.76,17.9 v17.76,20.47
  Bottom 0.203: U$1.P29 48.57,18.64 46.81,20.4 44.63,20.4 44.08,20.95 18.41,20.95 17.93,20.47 v17.76,20.47 | v16.51,17.14 17.14,17.14 17.9,17.9 18.42,17.9 18.79,17.53 18.79,12.99 R5.2
RESET  (via drill 0.35)
  Top 0.203: v18.48,18.99 18.16,18.67 v18.16,17.27 | RESET.2 v5.08,10.41
  Bottom 0.203: U$1.P26 47.88,16.99 46.08,18.79 18.68,18.79 v18.48,18.99 | v18.16,17.27 10.75,9.86 8.63,9.86 7.82,10.67 R8.1 5.33,10.67 v5.08,10.41
SCL
  Bottom 0.203: J2.4 33.04,6.37 33.38,6.71 42.44,6.71 42.47,6.67 42.98,6.67 44.36,8.05 46.61,8.05 47.07,8.51 47.07,9.49 47.24,9.66 47.24,11.95 47.17,12.03 47.17,13.03 47.93,13.8 U$1.P18
SCL1
  Bottom 0.203: J3.4 42.19,5.61 42.42,5.84 43.15,5.84 44.65,7.34 46.94,7.34 47.78,8.18 47.78,9.2 48.18,9.6 48.18,12.01 47.88,12.32 47.88,12.74 48.13,12.99 U$1.P16
SCLK
  Bottom 0.152: U$1.P52 56.88,14.19 58.9,12.17 58.9,11.72 59.21,11.41 60.48,11.41 60.79,11.1 61.77,11.1 62.23,10.64 62.23,10.18 62.21,10.16 62.21,10.11 61.97,9.88 U1.6
SD0
  Bottom 0.152: U1.5 60.59,10.38 59.86,11.11 59.09,11.11 58.59,11.6 58.59,12.04 56.85,13.79 U$1.P53
SD1
  Bottom 0.152: U$1.P55 56.23,12.99 56.46,12.75 56.46,9.96 57.04,9.38 U1.2
SD2
  Bottom 0.152: U$1.P54 56.33,13.39 56.77,12.95 56.77,10.31 57.2,9.88 U1.3
SD3
  Bottom 0.152: U$1.P51 56.91,14.59 59.2,12.3 59.2,11.85 59.34,11.72 60.61,11.72 60.92,11.4 61.9,11.4 62.61,10.69 62.61,10.13 62.51,10.03 62.51,9.81 62.08,9.38 U1.7
SDA
  Bottom 0.203: J2.3 34.04,6.23 34.16,6.35 42.29,6.35 42.44,6.2 43.01,6.2 44.51,7.7 46.79,7.7 47.42,8.33 47.42,9.34 47.68,9.6 47.68,12.02 47.52,12.17 47.52,12.88 48.03,13.39 U$1.P17
SDA1
  Bottom 0.203: J3.3 43.25,4.89 43.25,5.44 44.8,6.99 47.09,6.99 48.13,8.03 48.13,9.05 48.64,9.56 48.64,12.52 U$1.P15
SS_N  (via drill 0.25)
  Top 0.152: v56.16,6.91 56.16,8.84 v56.36,9.04
  Bottom 0.152: 55.39,12.51 U$1.P56 55.58,12.48 55.58,9.91 56.4,9.08 | 56.4,9.08 56.6,8.88 U1.1 | v56.36,9.04 56.4,9.08 | v56.16,6.91 55.88,6.99 55.88,6.67 55.91,6.64
  Bottom 0.203: R7.2 R6.1 9.09,25.4 9.9,26.2 11.11,26.2 11.26,26.05 11.26,23.29 16.19,18.36 21.9,18.36 31.62,8.64 31.62,2.92 31.67,2.97 52.25,2.97 55.91,6.64 56.16,6.88
VUSB  (via drill 0.35)
  Bottom 0.152: v5.71,2.54 6.99,2.54 C12.1 | v76.2,9.53 76.2,12.06 74.93,12.06 74.3,11.43 J1.VBUS2 | 73.56,16.42 73.66,16.51 J1.VBUS1
  Bottom 0.254: J1.VBUS2 74.77,11.52 75.31,12.06 75.31,15.75 74.64,16.42 J1.VBUS1
  Bottom 0.406: U$2.2 71.5,18.62 71.5,17.78 72.86,16.42 73.56,16.42
  pour Top: -3.81,31.75 85.09,31.75 85.09,-3.81 -3.81,-3.81
XIN
  Bottom 0.203: C15.1 44.72,10.66 Y1.1 45.22,11.41 46.12,12.31 46.12,13.99 46.72,14.59 U$1.P20
XOUT
  Bottom 0.203: R9.2 44.95,14.99 U$1.P21

### Text on the board
bNames: _ | PixelLeaf RP2040 / 5x10 Matrix / Oak Dev Tech